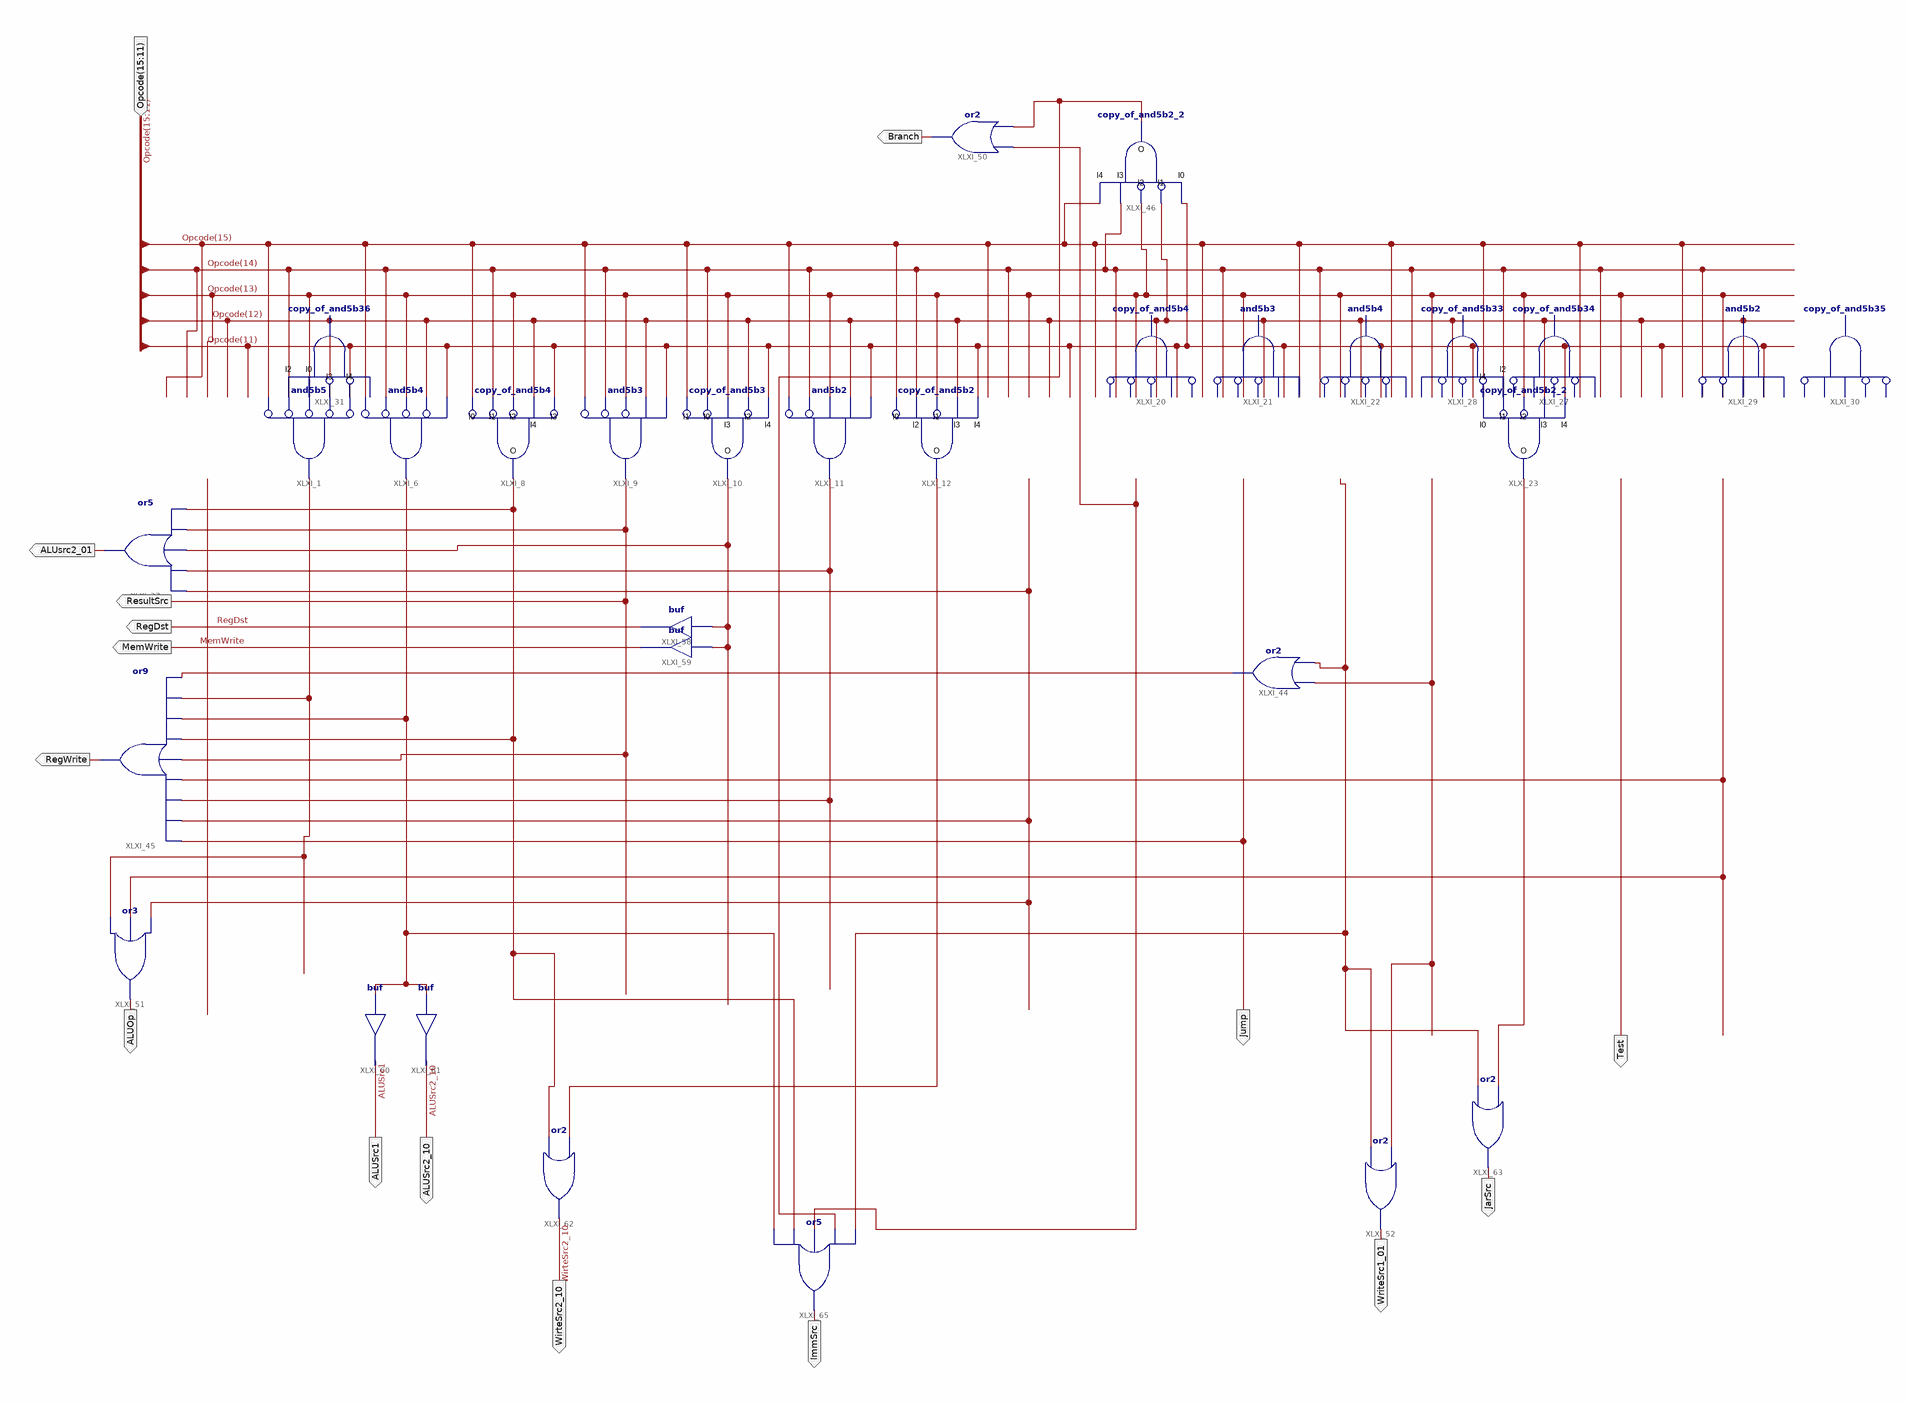
[diagram p0: schematic sheet 1]
// Xilinx ISE schematic main_decoder.sch (spartan3e) as structural Verilog: 30 symbols, 16 ports
module main_decoder (
  input  [15:11] Opcode,
  output Jump,
  output Test,
  output ResultSrc,
  output ALUsrc2_01,
  output RegDst,
  output MemWrite,
  output Branch,
  output ALUOp,
  output RegWrite,
  output ALUSrc1,
  output ALUSrc2_10,
  output WirteSrc2_10,
  output WriteSrc1_01,
  output JarSrc,
  output ImmSrc
);

  wire XLXN_37, XLXN_38, XLXN_43, XLXN_44, XLXN_45, XLXN_49, XLXN_50, XLXN_52, XLXN_76, XLXN_86, XLXN_93,
       XLXN_128, XLXN_129, XLXN_130, XLXN_132;

  and XLXI_1 (XLXN_38, ~Opcode[15], ~Opcode[14], ~Opcode[13], ~Opcode[12], ~Opcode[11]);  // and5b5
  and XLXI_6 (XLXN_129, ~Opcode[15], ~Opcode[14], ~Opcode[13], ~Opcode[12], Opcode[11]);  // and5b4
  copy_of_and5b4 XLXI_8 (
    .I0(Opcode[15]), .I1(Opcode[14]), .I2(Opcode[13]), .O(XLXN_130), .I4(Opcode[12]), .I3(Opcode[11]));
  and XLXI_9 (ResultSrc, ~Opcode[15], ~Opcode[14], ~Opcode[13], Opcode[12], Opcode[11]);  // and5b3
  copy_of_and5b3 XLXI_10 (
    .O(XLXN_76), .I4(Opcode[11]), .I2(Opcode[12]), .I0(Opcode[14]), .I3(Opcode[13]), .I1(Opcode[15]));
  and XLXI_11 (XLXN_43, ~Opcode[15], ~Opcode[14], Opcode[13], Opcode[12], Opcode[11]);  // and5b2
  copy_of_and5b2 XLXI_12 (
    .I0(Opcode[15]), .I3(Opcode[12]), .I4(Opcode[11]), .O(XLXN_44), .I1(Opcode[13]), .I2(Opcode[14]));
  copy_of_and5b4 XLXI_20 (
    .I0(Opcode[11]), .I1(Opcode[12]), .I2(Opcode[13]), .O(XLXN_45), .I4(Opcode[14]), .I3(Opcode[15]));
  and XLXI_21 (XLXN_93, ~Opcode[11], ~Opcode[12], ~Opcode[13], Opcode[14], Opcode[15]);  // and5b3
  and XLXI_22 (Jump, ~Opcode[11], ~Opcode[12], ~Opcode[13], ~Opcode[14], Opcode[15]);  // and5b4
  copy_of_and5b2_2 XLXI_23 (
    .I0(Opcode[15]), .I1(Opcode[14]), .I3(Opcode[12]), .I4(Opcode[11]), .O(XLXN_50), .I2(Opcode[13]));
  copy_of_and5b34 XLXI_27 (
    .I0(Opcode[11]), .O(XLXN_49), .I4(Opcode[15]), .I2(Opcode[14]), .I3(Opcode[12]), .I1(Opcode[13]));
  copy_of_and5b33 XLXI_28 (
    .I1(Opcode[12]), .O(XLXN_128), .I4(Opcode[15]), .I2(Opcode[14]), .I3(Opcode[11]), .I0(Opcode[13]));
  and XLXI_29 (Test, ~Opcode[11], ~Opcode[12], Opcode[13], Opcode[14], Opcode[15]);  // and5b2
  copy_of_and5b35 XLXI_30 (
    .I0(Opcode[11]), .O(XLXN_52), .I2(Opcode[14]), .I3(Opcode[12]), .I1(Opcode[15]), .I4(Opcode[13]));
  copy_of_and5b36 XLXI_31 (
    .O(XLXN_37), .I2(Opcode[14]), .I3(Opcode[12]), .I0(Opcode[13]), .I4(Opcode[11]), .I5(Opcode[15]));
  or XLXI_37 (ALUsrc2_01, XLXN_130, ResultSrc, XLXN_76, XLXN_43, XLXN_45);
  or XLXI_44 (XLXN_86, XLXN_128, XLXN_49);
  or XLXI_45 (RegWrite, XLXN_86, XLXN_38, XLXN_129, XLXN_130, ResultSrc, XLXN_52, XLXN_43, XLXN_45, Jump);
  copy_of_and5b2_2 XLXI_46 (
    .I0(Opcode[11]), .I1(Opcode[12]), .I3(Opcode[14]), .I4(Opcode[15]), .O(XLXN_132), .I2(Opcode[13]));
  or XLXI_50 (Branch, XLXN_132, XLXN_93);
  or XLXI_51 (ALUOp, XLXN_38, XLXN_52, XLXN_45);
  or XLXI_52 (WriteSrc1_01, XLXN_128, XLXN_49);
  buf XLXI_58 (RegDst, XLXN_76);
  buf XLXI_59 (MemWrite, XLXN_76);
  buf XLXI_60 (ALUSrc1, XLXN_129);
  buf XLXI_61 (ALUSrc2_10, XLXN_129);
  or XLXI_62 (WirteSrc2_10, XLXN_130, XLXN_44);
  or XLXI_63 (JarSrc, XLXN_128, XLXN_50);
  or XLXI_65 (ImmSrc, XLXN_129, XLXN_130, XLXN_93, XLXN_132, XLXN_128);
endmodule
